# EAGLE schematic Syn-ArduinoShield-v1a (EAGLE 5.10)
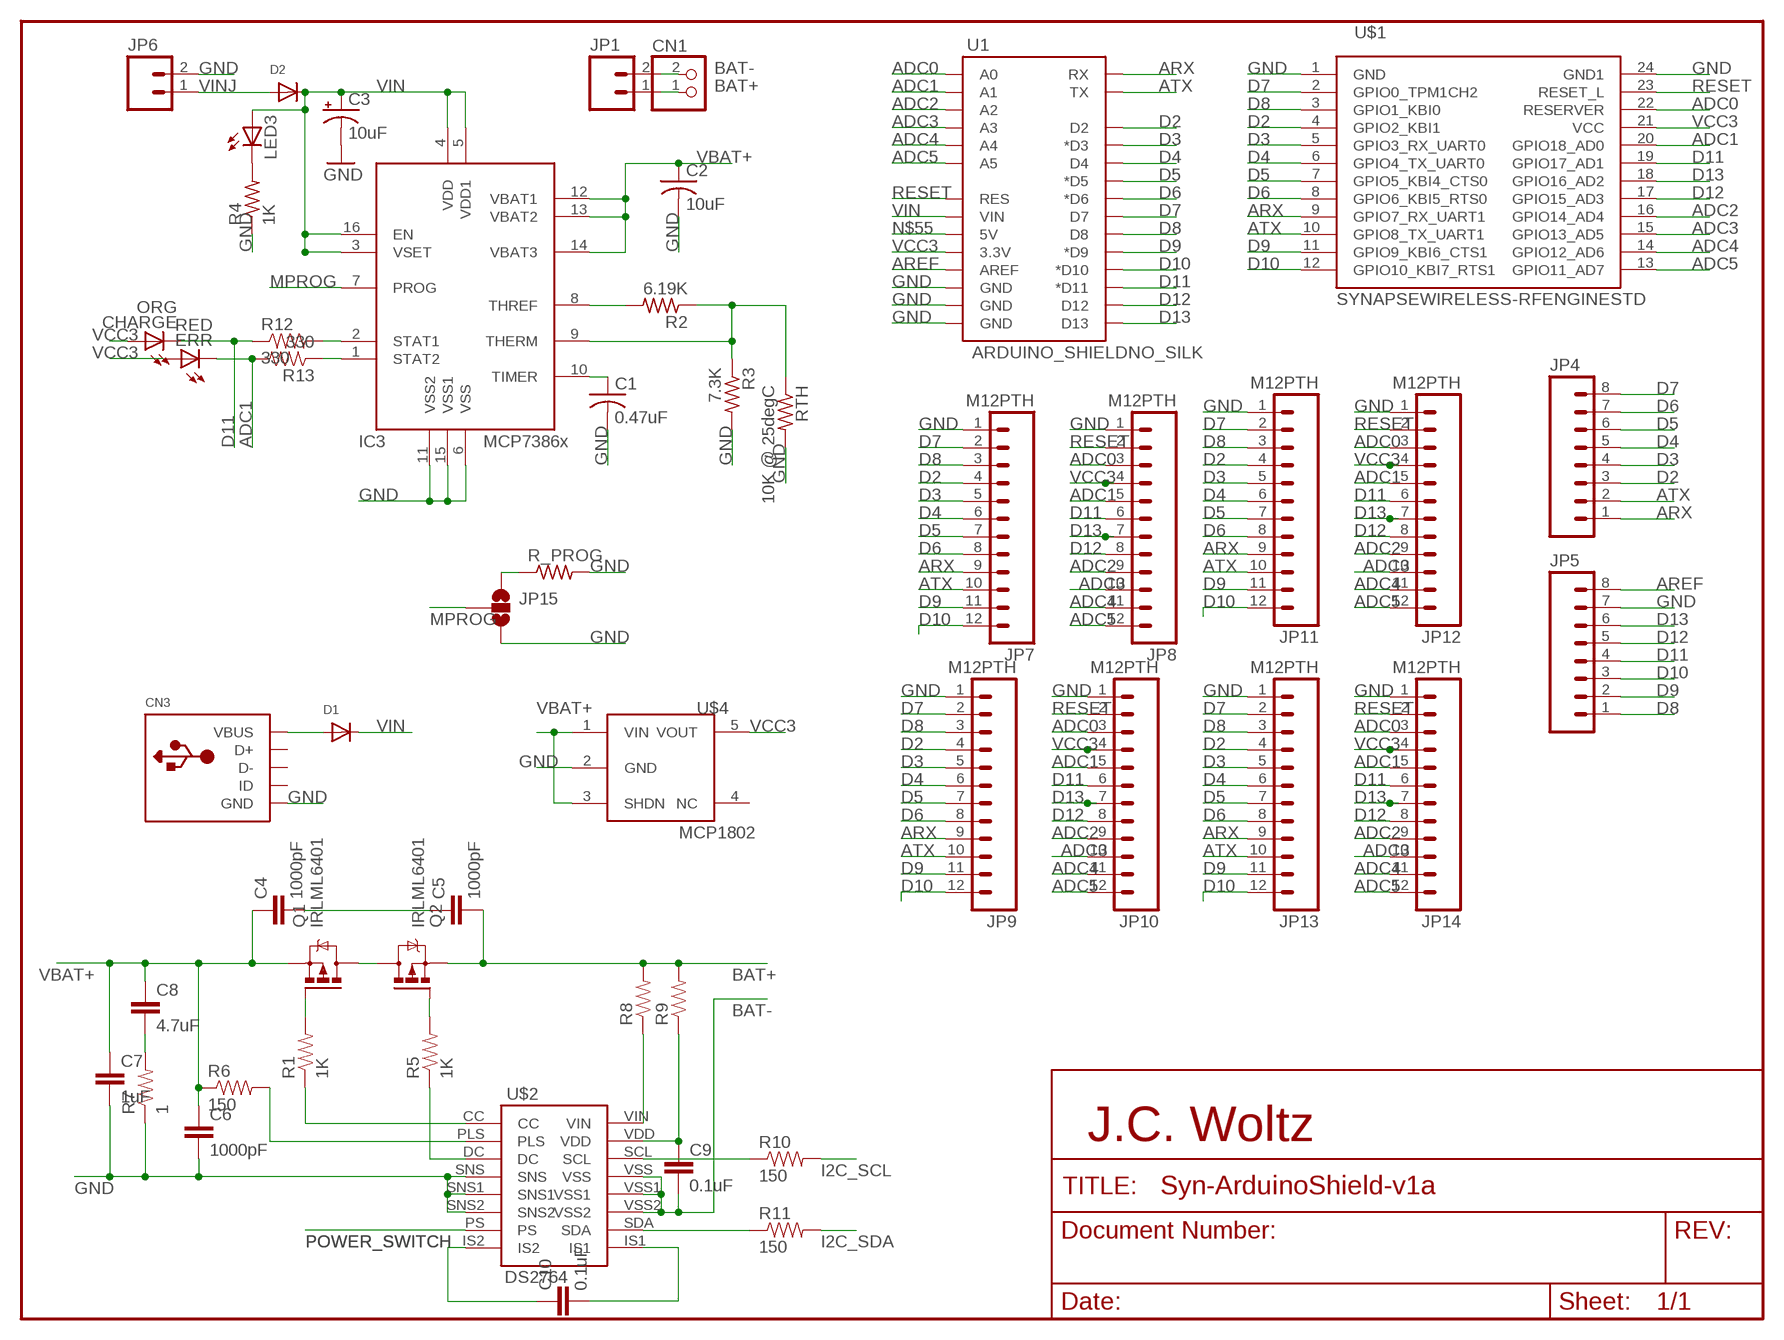
[diagram p0: schematic, sheet 1]

## Parts
C1  0.47uF  C-USC0603  [C0603]
C2  10uF  C-USC0603  [C0603]
C3  10uF  CAP_POL1206  [EIA3216]
C4  1000pF  CAP0603-CAP  [0603-CAP]
C5  1000pF  CAP0603-CAP  [0603-CAP]
C6  1000pF  CAP0603-CAP  [0603-CAP]
C7  1uF  CAP0603-CAP  [0603-CAP]
C8  4.7uF  CAP0603-CAP  [0603-CAP]
C9  0.1uF  CAP0603-CAP  [0603-CAP]
C10  0.1uF  CAP0603-CAP  [0603-CAP]
CHARGE  ORG  LEDCHIPLED_0603  [CHIPLED_0603]
CN1  JST_2PIN-THM-RA  [JST-PH-2-THM-RA]
CN3  USBMINIB  [USB-MINIB]
D1  DIODESOD-323  [SOD-323]
D2  DIODESOD-323  [SOD-323]
ERR  RED  LEDCHIPLED_0603  [CHIPLED_0603]
IC3  MCP7386XS  [SO16]
JP1  M02PTH  [1X02]
JP4  M08  [1X08]
JP5  M08  [1X08]
JP6  M023.5MM  [SCREWTERMINAL-3.5MM-2]
JP7  M12PTH  [1X12]
JP8  M12PTH  [1X12]
JP9  M12PTH  [1X12]
JP10  M12PTH  [1X12]
JP11  M12PTH  [1X12]
JP12  M12PTH  [1X12]
JP13  M12PTH  [1X12]
JP14  M12PTH  [1X12]
JP15  SOLDERJUMPER_2WAYT  [SJ_2]
LED3  LEDCHIPLED_0603  [CHIPLED_0603]
Q1  IRLML6401  IRLML5203  [MICRO3]
Q2  IRLML6401  IRLML5203  [MICRO3]
R1  1K  RESISTOR0603-RES  [0603-RES]
R2  6.19K  R-US_R0603  [R0603]
R3  7.3K  R-US_R0603  [R0603]
R4  1K  R-US_R0603  [R0603]
R5  1K  RESISTOR0603-RES  [0603-RES]
R6  150  RESISTOR0603-RES  [0603-RES]
R7  1  RESISTOR0603-RES  [0603-RES]
R8  RESISTOR0603-RES  [0603-RES]
R9  RESISTOR0603-RES  [0603-RES]
R10  150  RESISTOR0603-RES  [0603-RES]
R11  150  RESISTOR0603-RES  [0603-RES]
R12  330  RESISTOR0603-RES  [0603-RES]
R13  330  RESISTOR0603-RES  [0603-RES]
R_PROG  R-US_FLIPFLOP  [0805-THM]
RTH  10K @ 25degC  R-US_FLIPFLOP  [0805-THM]
U1  ARDUINO_SHIELDNO_SILK  [DUEMILANOVE_VIAS]
U$1  SYNAPSEWIRELESS-RFENGINESTD  [SYNAPSERF100]
U$2  DS2764  [DS2764]
U$4  MCP1802  [SOT23-5]

## Nets
ADC0: JP8.3 JP10.3 JP12.3 JP14.3 U1.A0 U$1.22(RESERVER)
ADC1: ERR.C JP8.5 JP10.5 JP12.5 JP14.5 R13.2 U1.A1 U$1.20(GPIO18_AD0)
ADC2: JP8.9 JP10.9 JP12.9 JP14.9 U1.A2 U$1.16(GPIO14_AD4)
ADC3: JP8.10 JP10.10 JP12.10 JP14.10 U1.A3 U$1.15(GPIO13_AD5)
ADC4: JP8.11 JP10.11 JP12.11 JP14.11 U1.A4 U$1.14(GPIO12_AD6)
ADC5: JP8.12 JP10.12 JP12.12 JP14.12 U1.A5 U$1.13(GPIO11_AD7)
AREF: JP5.8 U1.AREF
ARX: JP4.1 JP7.9 JP9.9 JP11.9 JP13.9 U1.RX U$1.9(GPIO7_RX_UART1)
ATX: JP4.2 JP7.10 JP9.10 JP11.10 JP13.10 U1.TX U$1.10(GPIO8_TX_UART1)
BAT+: C5.2 CN1.1 JP1.1 Q2.2(S) R8.2 R9.2
BAT-: C9.2 CN1.2 JP1.2 U$2.VSS U$2.VSS1 U$2.VSS2
D2: JP4.3 JP7.4 JP9.4 JP11.4 JP13.4 U1.D2 U$1.4(GPIO2_KBI1)
D3: JP4.4 JP7.5 JP9.5 JP11.5 JP13.5 U1.D3(*D3) U$1.5(GPIO3_RX_UART0)
D4: JP4.5 JP7.6 JP9.6 JP11.6 JP13.6 U1.D4 U$1.6(GPIO4_TX_UART0)
D5: JP4.6 JP7.7 JP9.7 JP11.7 JP13.7 U1.D5(*D5) U$1.7(GPIO5_KBI4_CTS0)
D6: JP4.7 JP7.8 JP9.8 JP11.8 JP13.8 U1.D6(*D6) U$1.8(GPIO6_KBI5_RTS0)
D7: JP4.8 JP7.2 JP9.2 JP11.2 JP13.2 U1.D7 U$1.2(GPIO0_TPM1CH2)
D8: JP5.1 JP7.3 JP9.3 JP11.3 JP13.3 U1.D8 U$1.3(GPIO1_KBI0)
D9: JP5.2 JP7.11 JP9.11 JP11.11 JP13.11 U1.D9(*D9) U$1.11(GPIO9_KBI6_CTS1)
D10: JP5.3 JP7.12 JP9.12 JP11.12 JP13.12 U1.D10(*D10) U$1.12(GPIO10_KBI7_RTS1)
D11: CHARGE.C JP5.4 JP8.6 JP10.6 JP12.6 JP14.6 R12.1 U1.D11(*D11) U$1.19(GPIO17_AD1)
D12: JP5.5 JP8.8 JP10.8 JP12.8 JP14.8 U1.D12 U$1.17(GPIO15_AD3)
D13: JP5.6 JP8.7 JP10.7 JP12.7 JP14.7 U1.D13 U$1.18(GPIO16_AD2)
GND: C1.2 C2.2 C3.C(-) C6.2 C7.2 CN3.GND IC3.6(VSS) IC3.11(VSS2) IC3.15(VSS1) JP5.7 JP6.2 JP7.1 JP8.1 JP9.1 JP10.1 JP11.1 JP12.1 JP13.1 JP14.1 JP15.3 R3.2 R4.1 R7.1 R_PROG.2 RTH.2 U1.GND@0(GND) U1.GND@1(GND) U1.GND@2(GND) U$1.1(GND) U$1.24(GND1) U$2.SNS U$2.SNS1 U$2.SNS2 U$4.2(GND)
I2C_SCL: R10.2
I2C_SDA: R11.2
MPROG: IC3.7(PROG) JP15.2
N$1: IC3.1(STAT2) R13.1
N$2: LED3.C R4.2
N$3: Q1.1(G) R1.2
N$4: Q2.1(G) R5.2
N$5: IC3.2(STAT1) R12.2
N$6: R11.1 U$2.SDA
N$7: IC3.8(THREF) R2.2
N$8: IC3.9(THERM) R2.1 R3.1 RTH.1
N$9: C1.1 IC3.10(TIMER)
N$10: C4.2 C5.1
N$11: JP15.1 R_PROG.1
N$12: R1.1 U$2.CC
N$14: R5.1 U$2.DC
N$15: C8.2 R7.2
N$16: R8.1 U$2.VIN
N$17: C9.1 R9.1 U$2.VDD
N$18: Q1.3(D) Q2.3(D)
N$19: C10.1 U$2.IS2
N$20: R10.1 U$2.SCL
N$21: CN3.VBUS D1.A
N$22: C10.2 U$2.IS1
N$24: R6.2 U$2.PLS
N$55: U1.5V
POWER_SWITCH: U$2.PS
RESET: JP8.2 JP10.2 JP12.2 JP14.2 U1.RES U$1.23(RESET_L)
VBAT+: C2.1 C4.1 C6.1 C7.1 C8.1 IC3.12(VBAT1) IC3.13(VBAT2) IC3.14(VBAT3) Q1.2(S) R6.1 U$4.1(VIN) U$4.3(SHDN)
VCC3: CHARGE.A ERR.A JP8.4 JP10.4 JP12.4 JP14.4 U1.3.3V U$1.21(VCC) U$4.5(VOUT)
VIN: C3.A(+) D1.C D2.C IC3.3(VSET) IC3.4(VDD) IC3.5(VDD1) IC3.16(EN) LED3.A U1.VIN
VINJ: D2.A JP6.1
Unconnected: CN3.D+ CN3.D- CN3.ID U$4.4(NC)

## Notes on the sheet
- J.C. Woltz

## Library data of the parts
C1 C2 = adafruit:C-US: CAPACITOR, American symbol
C3 = SparkFun:CAP_POL: Capacitor Polarized These are standard SMD and PTH capacitors. Normally 10uF, 47uF, and 100uF in electrolytic and tantalum varieties. Always verify the external diameter of the through hole cap, it varies with capacity, voltage, and manufacturer. The EIA devices should be standard.
C4-C10 = SparkFun:CAP: Capacitor Standard 0603 ceramic capacitor, and 0.1" leaded capacitor.
CHARGE ERR LED3 = adafruit:LED: LED OSRAM: - CHIPLED LG R971, LG N971, LY N971, LG Q971, LY Q971, LO R971, LY R971 LH N974, LH R974 LS Q976, LO Q976, LY Q976 LO Q996 - Hyper CHIPLED LW Q18S LB Q993, LB Q99A, LB R99A - SideLED LS A670, LO A670, LY A670, LG A670, LP A670 LB A673, LV A673, LT A673, LW A673 LH A674 LY A675 LS A676, LA A676, LO A676, LY A676, LW A676 LS A679, LY A679, LG A679 - Hyper Micro SIDELED® LS Y876, LA Y876, LO Y876, LY Y876 LT Y87S - SmartLED LW L88C, LW L88S LB L89C, LB L89S, LG L890 LS L89K, LO L89K, LY L89K LS L896, LA L896, LO L896, LY L896 - TOPLED LS T670, LO T670, LY T670, LG T670, LP T670 LSG T670, LSP T670, LSY T670, LOP T670, LYG T670 LG T671, LOG T671, LSG T671 LB T673, LV T673, LT T673, LW T673 LH T674 LS T676, LA T676, LO T676, LY T676, LB T676, LH T676, LSB T676, LW T676 LB T67C, LV T67C, LT T67C, LS T67K, LO T67K, LY T67K, LW E67C LS E67B, LA E67B, LO E67B, LY E67B, LB E67C, LV E67C, LT E67C LW T67C LS T679, LY T679, LG T679 LS T770, LO T770, LY T770, LG T770, LP T770 LB T773, LV T773, LT T773, LW T773 LH T774 LS E675, LA E675, LY E675, LS T675 LS T776, LA T776, LO T776, LY T776, LB T776 LHGB T686 LT T68C, LB T68C - Hyper Mini TOPLED® LB M676 - Mini TOPLED Santana® LG M470 LS M47K, LO M47K, LY M47K Source: http://www.osram.convergy.de/
CN1 = adafruit:JST_2PIN: JST 2-Pin Connectors of various flavors SMT-RA (S2B-PH-SM4) 4UConnector #17311 SMT (B2B-PH-SM4) THM-RA (S2B-PH) THM (B2B-PH)
CN3 = adafruit:USB: USB Connectors USBMINIB - Surface Mount Female Mini-B USB Connector 4UConnector: 06564 By microbuilder.eu Thru-hole RA Female Mini-B USB Connector 4UConnector: 18732 By ladyada.net
D1 D2 = adafruit:DIODE: Diode SMADIODE - SMA Surface Mount Package 20V 1A Schottky Diode Digikey: 641-1014-6-ND DO-1N4148 - Through Hole Small Current Diode SOD-123 20V 1 A (.5mV Vf) Schottky Diode - Digikey: MBRX120TPMSCT-ND SOD-323 10V 570mA (.38mV Vf, 3ns) Schottky Diode - Digikey: ZLLS410CT-ND SOD-523 30V 30mA Schottky Diode (RB751S-40TE61) - Digikey: RB751S-40TE61CT-ND SOT23-R/W - SOT23 Package (R = Solder Paste/Reflow Ovens, W = Hand-Soldering) BAT54Film 40V 300mA - Digikey: 497-7162-1-ND
IC3 = adafruit:MCP7386X: MCP7386x 4.1, 4.2, 8.2, 8.4 LiPoly battery charger chip family, with wide DC input, thermal cutoff, adjustable curret, and indicator LEDs
JP1 JP6 = SparkFun:M02: Header 2 Standard 2-pin 0.1" header. Use with straight break away headers (SKU : PRT-00116), right angle break away headers (PRT-00553), swiss pins (PRT-00743), machine pins (PRT-00117), and female headers (PRT-00115). Molex polarized connector foot print use with SKU : PRT-08233 with associated crimp pins and housings.
JP4 JP5 = SparkFun:M08: Header 8 Standard 8-pin 0.1" header. Use with straight break away headers (SKU : PRT-00116), right angle break away headers (PRT-00553), swiss pins (PRT-00743), machine pins (PRT-00117), and female headers (PRT-00115).
JP7-JP14 = SparkFun:M12: Header 12 Standard 12-pin 0.1" header. Use with straight break away headers (SKU : PRT-00116), right angle break away headers (PRT-00553), swiss pins (PRT-00743), machine pins (PRT-00117), and female headers (PRT-00115).
JP15 = SparkFun:SOLDERJUMPER_2WAY: Solder Jumper 2 way solder jumper
Q1 Q2 = transistor-power:IRLML5203: HEXFET P-Channel Power MOSFET
R1 R5-R13 = SparkFun:RESISTOR: Resistor Basic schematic elements and footprints for 0603, 1206, and PTH 1/10th watt (small) resistors.
R2-R4 R_PROG RTH = adafruit:R-US_: RESISTOR, American symbol
U1 = SparkFun:ARDUINO_SHIELD
U$1 = 0_jc-custom:SYNAPSEWIRELESS-RFENGINE
U$2 = ssozonoff:DS2764
U$4 = 0_jc-modified:MCP1802